# Altium project NNLightSwitcher.PrjPcb (part 2 of 5)

## Sheet NNLightSwitcher_WiFi.SchDoc
size A3
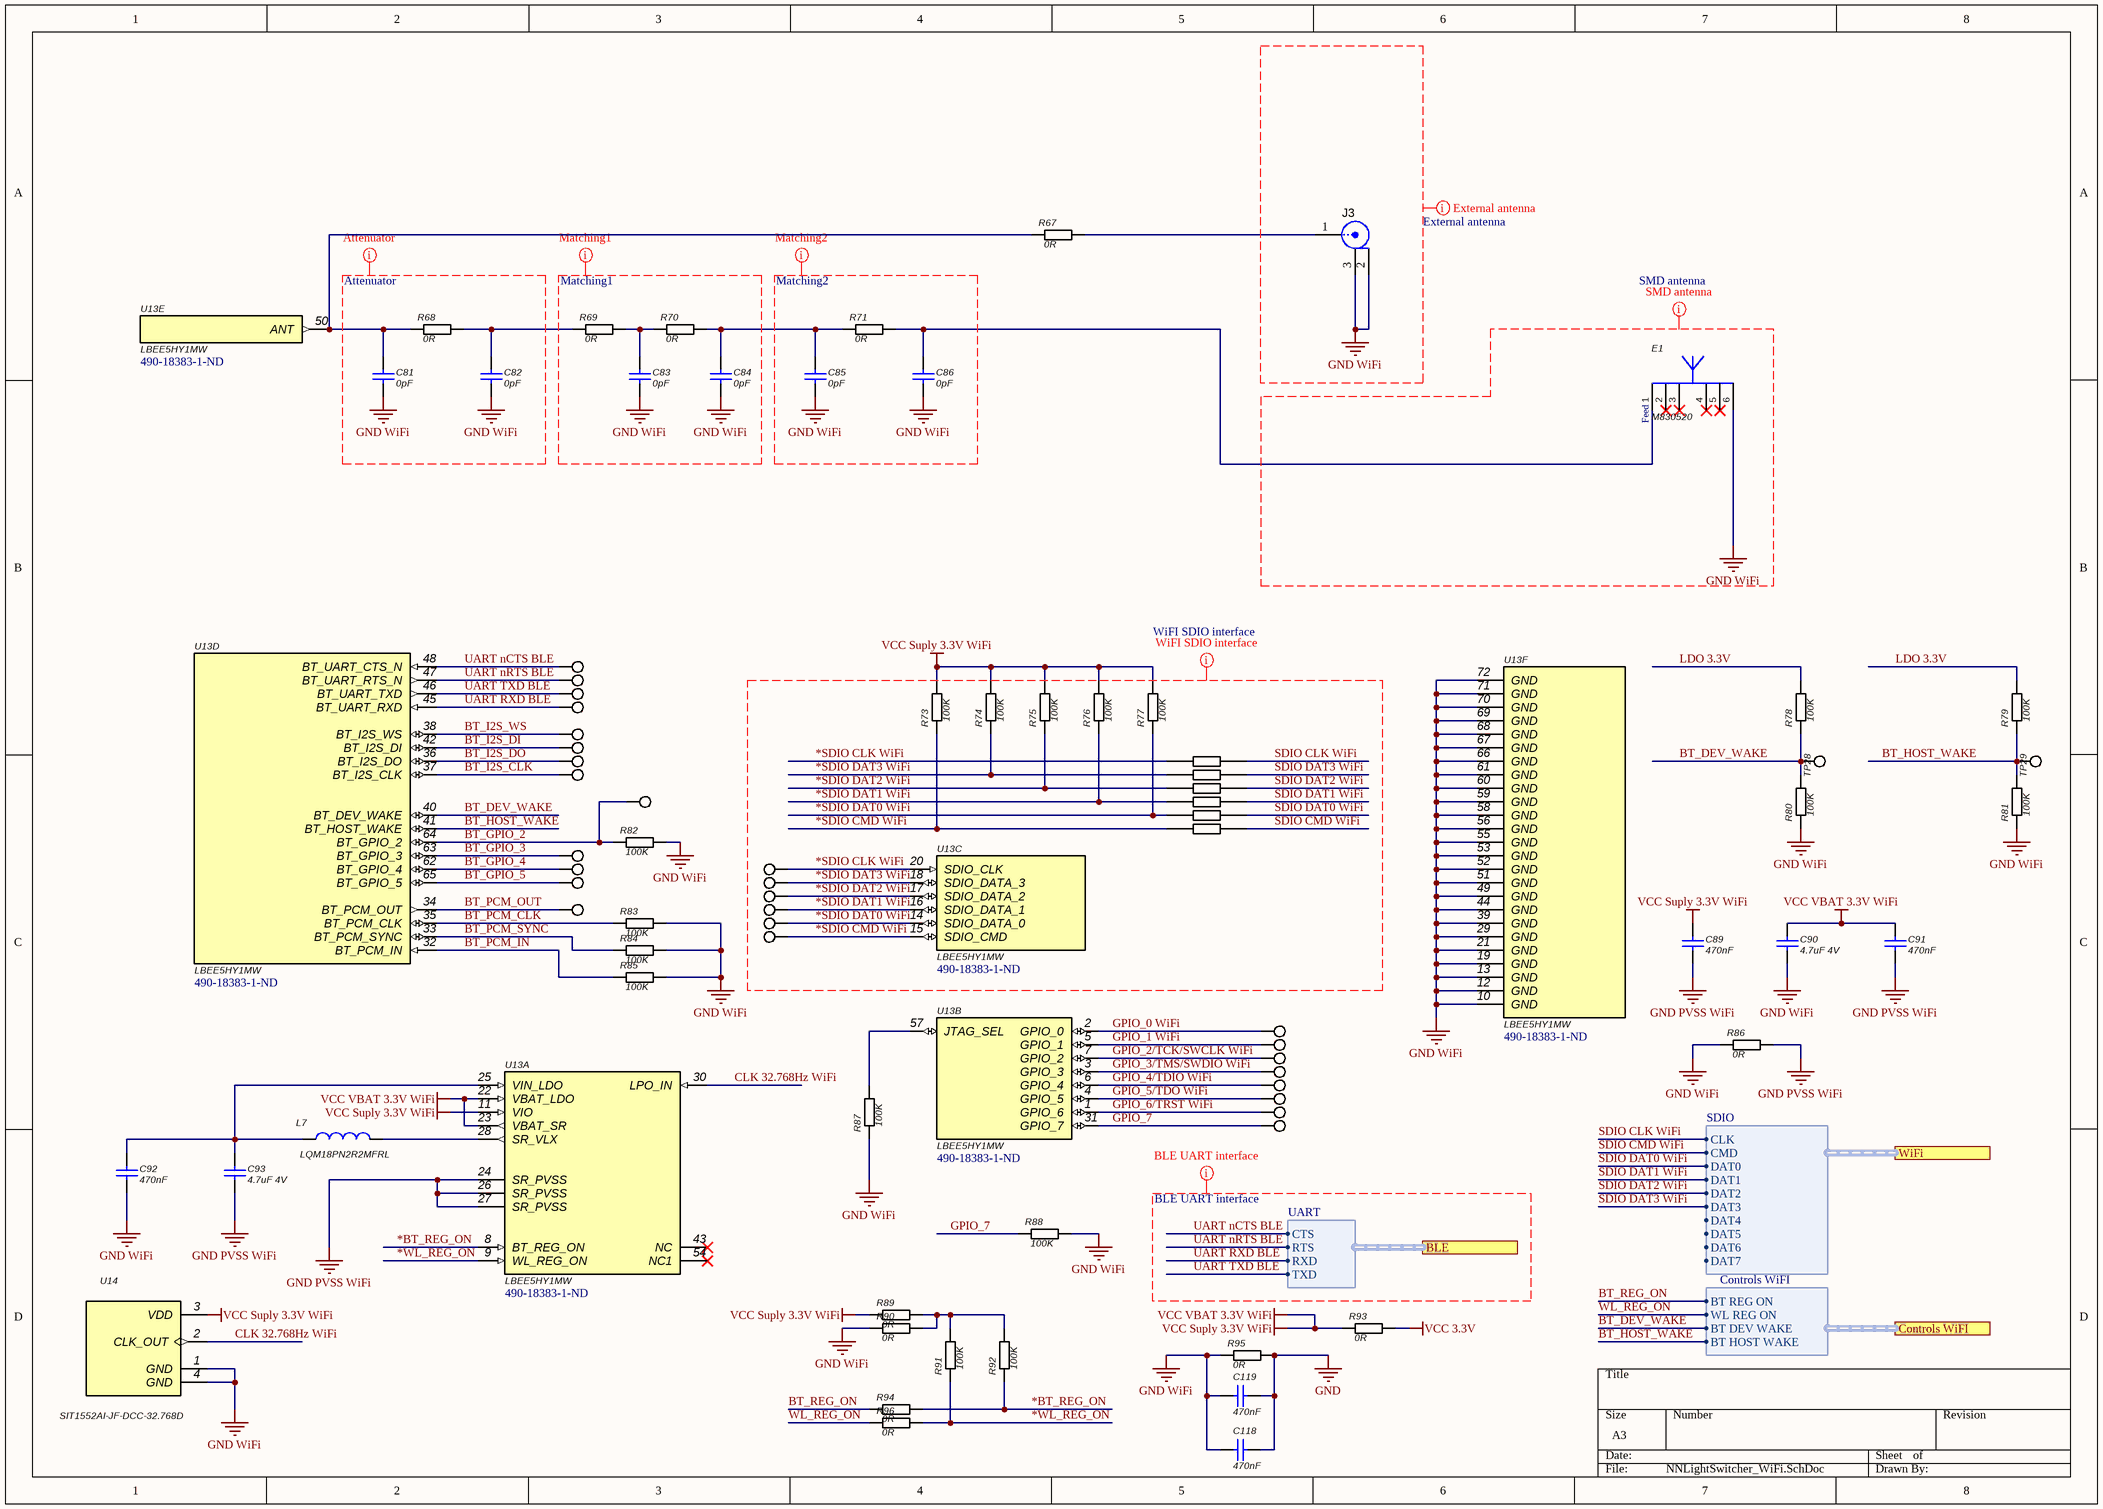
[diagram p6: NNLightSwitcher_WiFi.SchDoc]

### Parts
(Parts that share a designator on the sheet are numbered #1, #2 ... from top to bottom, then left to right.)
C81  0pF  [0402]
C82  0pF  [0402]
C83  0pF  [0402]
C84  0pF  [0402]
C85  0pF  [0402]
C86  0pF  [0402]
C89  470nF  [0402]
C90  4.7uF 4V  [0402]
C91  470nF  [0402]
C92  470nF  [0402]
C93  4.7uF 4V  [0402]
C118  470nF  [0402]
C119  470nF  [0402]
E1  M830520  [Ethertronics_M830520]
J3#1  U.FL-R-SMT-1(01)  [CONN_UFL-R-SMT-1]  (value not drawn)
L7  LQM18PN2R2MFRL  [*0603]
R67  0R  [0402]
R68  0R  [0402]
R69  0R  [0402]
R70  0R  [0402]
R71  0R  [0402]
R73  100K  [0402]
R74  100K  [0402]
R75  100K  [0402]
R76  100K  [0402]
R77  100K  [0402]
R78  100K  [0402]
R79  100K  [0402]
R80  100K  [0402]
R81  100K  [0402]
R82  100K  [0402]
R83  100K  [0402]
R84  100K  [0402]
R85  100K  [0402]
R86  0R  [0402]
R87  100K  [0402]
R88  100K  [0402]
R89  0R  [0402]
R90  0R  [0402]
R91  100K  [0402]
R92  100K  [0402]
R93  0R  [0402]
R94  0R  [0402]
R95  0R  [0402]
R96  0R  [0402]
RN27  EXB-2HV431JV  [*RESCAXE50P380X160X55-16N]  (value not drawn)  (parts A,B,C,D,E,F of 8)
TP21  Test point  [Testpoint_with_pad]  (value not drawn)
TP22  Test point  [Testpoint_with_pad]  (value not drawn)
TP23  Test point  [Testpoint_with_pad]  (value not drawn)
TP24  Test point  [Testpoint_with_pad]  (value not drawn)
TP25  Test point  [Testpoint_with_pad]  (value not drawn)
TP26  Test point  [Testpoint_with_pad]  (value not drawn)
TP27  Test point  [Testpoint_with_pad]  (value not drawn)
TP28  Test point  [Testpoint_with_pad]  (value not drawn)
TP29  Test point  [Testpoint_with_pad]  (value not drawn)
TP30  Test point  [Testpoint_with_pad]  (value not drawn)
TP31  Test point  [Testpoint_Keystone_Miniature]  (value not drawn)
TP32  Test point  [Testpoint_Keystone_Miniature]  (value not drawn)
TP33  Test point  [Testpoint_Keystone_Miniature]  (value not drawn)
TP34  Test point  [Testpoint_with_pad]  (value not drawn)
TP35  Test point  [Testpoint_Keystone_Miniature]  (value not drawn)
TP36  Test point  [Testpoint_with_pad]  (value not drawn)
TP37  Test point  [Testpoint_with_pad]  (value not drawn)
TP38  Test point  [Testpoint_Keystone_Miniature]  (value not drawn)
TP39  Test point  [Testpoint_with_pad]  (value not drawn)
TP40  Test point  [Testpoint_with_pad]  (value not drawn)
TP41  Test point  [Testpoint_with_pad]  (value not drawn)
TP42  Test point  [Testpoint_with_pad]  (value not drawn)
TP43  Test point  [Testpoint_with_pad]  (value not drawn)
TP44  Test point  [Testpoint_with_pad]  (value not drawn)
TP45  Test point  [Testpoint_with_pad]  (value not drawn)
TP46  Test point  [Testpoint_with_pad]  (value not drawn)
TP47  Test point  [Testpoint_with_pad]  (value not drawn)
TP48  Test point  [Testpoint_with_pad]  (value not drawn)
TP49  Test point  [Testpoint_Keystone_Miniature]  (value not drawn)
U13  LBEE5HY1MW  Supplier Part Number 1: 490-18383-1-ND  [1MW LGA]  (parts A,B,C,D,E,F of 6)
U14  SIT1552AI-JF-DCC-32.768D  [*BGA4C100X41P2X2_154X84X60N]

### Ports
BLE (harness UART), Controls WiFI (harness Controls WiFI), WiFi (harness SDIO)

### Harnesses
SDIO: CLK, CMD, DAT1, DAT0, DAT3, DAT2, DAT5, DAT4, DAT7, DAT6
Controls WiFI: BT DEV WAKE, WL REG ON, BT REG ON, BT HOST WAKE
UART: CTS, RTS, RXD, TXD

### Nets
GND: C118.2 C119.2 R95.2
GND PVSS WiFi: C89.2 C91.2 C93.2 R86.2 U13.24(SR_PVSS) U13.26(SR_PVSS) U13.27(SR_PVSS)
GND WiFi: C81.2 C82.2 C83.2 C84.2 C85.2 C86.2 C90.2 C92.2 C118.1 C119.1 E1.6 J3#1.2 J3#1.3 R80.1 R81.1 R82.2 R83.2 R84.2 R85.2 R86.1 R87.1 R88.2 R90.1 R95.1 U13.10(GND) U13.12(GND) U13.13(GND) U13.19(GND) U13.21(GND) U13.29(GND) U13.39(GND) U13.44(GND) U13.49(GND) U13.51(GND) U13.52(GND) U13.53(GND) U13.55(GND) U13.56(GND) U13.58(GND) U13.59(GND) U13.60(GND) U13.61(GND) U13.66(GND) U13.67(GND) U13.68(GND) U13.69(GND) U13.70(GND) U13.71(GND) U13.72(GND) U14.1(GND) U14.4(GND)
VCC 3.3V: R93.2
VCC Suply 3.3V WiFi: C89.1 C90.1 C91.1 R73.2 R74.2 R75.2 R76.2 R77.2 R89.1 R93.1 U13.11(VIO) U13.22(VBAT_LDO) U13.23(VBAT_SR) U14.3(VDD)  [also labelled VCC VBAT 3.3V WiFi]
*BT_REG_ON: R92.1 R94.2 U13.8(BT_REG_ON)
*SDIO CLK WiFi: RN27.1 TP34.1 U13.20(SDIO_CLK)
*SDIO CMD WiFi: R73.1 RN27.4 TP41.1 U13.15(SDIO_CMD)
*SDIO DAT0 WiFi: R77.1 RN27.2 TP40.1 U13.14(SDIO_DATA_0)
*SDIO DAT1 WiFi: R76.1 RN27.6 TP39.1 U13.16(SDIO_DATA_1)
*SDIO DAT2 WiFi: R75.1 RN27.3 TP37.1 U13.17(SDIO_DATA_2)
*SDIO DAT3 WiFi: R74.1 RN27.5 TP36.1 U13.18(SDIO_DATA_3)
*WL_REG_ON: R91.1 R96.2 U13.9(WL_REG_ON)
BT_DEV_WAKE: R78.1 R80.2 TP28.1 U13.40(BT_DEV_WAKE) ; port Controls WiFI.BT DEV WAKE
BT_GPIO_2: R82.1 TP31.1 U13.64(BT_GPIO_2)
BT_GPIO_3: TP32.1 U13.63(BT_GPIO_3)
BT_GPIO_4: TP33.1 U13.62(BT_GPIO_4)
BT_GPIO_5: TP35.1 U13.65(BT_GPIO_5)
BT_HOST_WAKE: R79.1 R81.2 TP29.1 U13.41(BT_HOST_WAKE) ; port Controls WiFI.BT HOST WAKE
BT_I2S_CLK: TP30.1 U13.37(BT_I2S_CLK)
BT_I2S_DI: TP26.1 U13.42(BT_I2S_DI)
BT_I2S_DO: TP27.1 U13.36(BT_I2S_DO)
BT_I2S_WS: TP25.1 U13.38(BT_I2S_WS)
BT_PCM_CLK: R83.1 U13.35(BT_PCM_CLK)
BT_PCM_IN: R85.1 U13.32(BT_PCM_IN)
BT_PCM_OUT: TP38.1 U13.34(BT_PCM_OUT)
BT_PCM_SYNC: R84.1 U13.33(BT_PCM_SYNC)
BT_REG_ON: R94.1 ; port Controls WiFI.BT REG ON
CLK 32.768Hz WiFi: U13.30(LPO_IN) U14.2(CLK_OUT)
GPIO_0 WiFi: TP42.1 U13.2(GPIO_0)
GPIO_1 WiFi: TP43.1 U13.5(GPIO_1)
GPIO_2/TCK/SWCLK WiFi: TP44.1 U13.7(GPIO_2)
GPIO_3/TMS/SWDIO WiFi: TP45.1 U13.3(GPIO_3)
GPIO_4/TDIO WiFi: TP46.1 U13.6(GPIO_4)
GPIO_5/TDO WiFi: TP47.1 U13.4(GPIO_5)
GPIO_6/TRST WiFi: TP48.1 U13.1(GPIO_6)
GPIO_7: R88.1 TP49.1 U13.31(GPIO_7)
LDO 3.3V: R78.2 R79.2
SDIO CLK WiFi: RN27.16 ; port WiFi.CLK
SDIO CMD WiFi: RN27.13 ; port WiFi.CMD
SDIO DAT0 WiFi: RN27.15 ; port WiFi.DAT0
SDIO DAT1 WiFi: RN27.11 ; port WiFi.DAT1
SDIO DAT2 WiFi: RN27.14 ; port WiFi.DAT2
SDIO DAT3 WiFi: RN27.12 ; port WiFi.DAT3
UART nCTS BLE: TP21.1 U13.48(BT_UART_CTS_N) ; port BLE.CTS  [project net GPIO26]
UART nRTS BLE: TP22.1 U13.47(BT_UART_RTS_N) ; port BLE.RTS  [project net GPIO14]
UART RXD BLE: TP24.1 U13.45(BT_UART_RXD) ; port BLE.RXD
UART TXD BLE: TP23.1 U13.46(BT_UART_TXD) ; port BLE.TXD
WL_REG_ON: R96.1 ; port Controls WiFI.WL REG ON  [project net GPIO16]
NetC81_1: C81.1 R67.1 R68.1 U13.50(ANT)
NetC82_1: C82.1 R68.2 R69.1
NetC83_1: C83.1 R69.2 R70.1
NetC84_1: C84.1 C85.1 R70.2 R71.1
NetC86_1: C86.1 E1.1(Feed) R71.2
NetC92_1: C92.1 C93.1 L7.1 U13.25(VIN_LDO)
NetJ3#1_1: J3#1.1 R67.2
NetL7_2: L7.2 U13.28(SR_VLX)
NetR87_2: R87.2 U13.57(JTAG_SEL)
NetR89_2: R89.2 R90.2 R91.2 R92.2

Not connected (* = marked no-connect by the designer): E1 2(GND)* 3(GND)* 4(Feed)* 5*; U13 43(NC)* 54(NC1)*

### Layout directives
net class Attenuator: GND WiFi
net class Matching1: GND WiFi
net class Matching2: GND WiFi
net class SMD antenna: GND WiFi
net class External antenna: GND WiFi
net class WiFI SDIO interface: *SDIO CLK WiFi, *SDIO CMD WiFi, *SDIO DAT0 WiFi, *SDIO DAT1 WiFi, *SDIO DAT2 WiFi, *SDIO DAT3 WiFi, SDIO CLK WiFi, SDIO CMD WiFi, SDIO DAT0 WiFi, SDIO DAT1 WiFi, SDIO DAT2 WiFi, SDIO DAT3 WiFi
net class BLE UART interface: UART nCTS BLE, UART nRTS BLE, UART RXD BLE, UART TXD BLE

### Notes on the sheet
- (near E1) Feed
- “Attenuator” part should be pi-network as above.
  Appropriate value of R depends on the design of the product.
  Put 0 ohm in series and no load in parallel on the initial design.
- “Matching1” part should be pi-network + 1 series component as above.
  Appropriate value of L/C/R depends on the design of the product.
  Put 0 ohm in series and no load in parallel on the initial design.
- “Matching2” part should be pi-network as above.
  Only matching1 might achieve the antenna tuning, but if you have a place
  to have this part, please add it.
  Appropriate value of L/C/R depends on the design of the product.
  Put 0 ohm in series and no load in parallel on the initial design.
- Open: SDIO interface voltage=1.8V
  10kohm PD: SDIO interface voltage=3.3V

### Library data of the parts
C81-C86 = Capacitor 0pF: ComponentLink1Description: Datasheet link; ComponentLink1URL: http://www.yageo.com/documents/recent/UPY-GP_NP0_16V-to-50V_16.pdf
C89 C91 C92 C118 C119 = Capacitor 470nF: ComponentLink1Description: Datasheet link; ComponentLink1URL: http://www.yageo.com/documents/recent/UPY-GP_NP0_16V-to-50V_16.pdf
C90 C93 = Capacitor 4.7uF 4V: ComponentLink1Description: Datasheet link; ComponentLink1URL: http://www.yageo.com/documents/recent/UPY-GP_NP0_16V-to-50V_16.pdf
E1 = 2.4-5 GHz antenna: WLAN ANTENNA 802.11, SMD; Manufacturer 1: Ethertronics; ComponentLink1Description: Datasheet URL; ComponentLink1URL: http://www.ethertronics.com/files/6014/0708/4228/Savvi_WLAN__8x3_M830510.pdf; Supplier 1: Digi-Key; Manufacturer Part Number 1: M830520; Stock 1: 10391; Pricing 1: 1=2,09000, 10=1,87400, 25=1,76800, 100=1,50630, 250=1,41440, 500=1,23760 (USD); RoHS: No; ComponentLink2URL: https://media.digikey.com/pdf/Data%20Sheets/Ethertronics/M830520.pdf?src-supplier=Digi-Key; ComponentLink2Description: https://media.digikey.com/pdf/Data%20Sheets/Ethertronics/M830520.pdf?src-supplier=Digi-Key; Supplier Part Number 1: 939-1070-1-ND
J3#1 = CMP-0075320-1: Receptacle, Ultra Miniature Coaxial, Male Pin, 50 ohm, SMT; Manufacturer: Hirose Electric Co. Ltd.; Alternate Manufacturer: ----; CNHeader: False; Gender: Female; ContactFinish: Gold; PartNumber: U.FL-R-SMT-1(01); PackageReference: Ultra small CO-AX SMD; CompType: Receptacle; RoHS: Y; MountType: SMT; ComponentLink1Description: Datasheet URL; ComponentLink1URL: https://www.hirose.com/product/en/download_file/key_name/U.FL%2DR%2DSMT%2D1%2801%29/category/Drawing%20(2D)/doc_file_id/37625/?file_category_id=6&item_id=03310472201&is_series=; Publisher: Texas Instruments; LatestRevisionDate: 2017-07-12; Alternate PartNumber: ----; Supplier 1: Digi-Key; Supplier Part Number 1: H122041-ND; Supplier 2: Newark; Supplier Part Number 2: 18K7517; Supplier 3: Mouser; Supplier Part Number 3: 798-U.FL-R-SMT01; Color: Beige; PinCount: 3; Orientation: Vertical; CT: False
L7 = LQM18PN2R2MFRL: Inductor Power Chip Shielded Multi-Layer 2.2uH 20% 1MHz Ferrite 750mA 375mOhm DCR 0603 T/R; Manufacturer 1: Murata; DC Resistance (DCR): 375mR; Self Resonant Frequency: 70MHz; Value: *; Case/Package: 0603; Case Code (Imperial): 0603; Case Code (Metric): 1608; ComponentLink1Description: https://datasheet.ciiva.com/29691/o05e-29691382.pdf?src-supplier=Digi-Key; ComponentLink1URL: https://datasheet.ciiva.com/29691/o05e-29691382.pdf?src-supplier=Digi-Key; Core Material: Ferrite; Current Rating: 750mA; DC Current: 750mA; Depth: 0.95mm; Height - Seated (Max): 0.037inch; Height: 0.8mm; Inductance: 2.2uH; Lead Free: Lead Free; Length: 0.063inch; Manufacturer 2: Murata; Manufacturer Part Number 1: LQM18PN2R2MFRL; Manufacturer Part Number 2: LQM18PN2R2MFRL; Max DC Current: 750mA; Max Operating Temperature: 85°C; Military Standard: Not; Min Operating Temperature: -40°C; Mount: Surface Mount; Package Quantity: 4000; Packaging: Tape and Reel; Pricing 1: 1=0,42000, 10=0,37000, 100=0,25430, 500=0,21728, 1000=0,16643 (USD); Pricing 2: 1=0,42000, 10=0,37000, 50=0,37000, 100=0,25400, 500=0,21700, 1000=0,16600, 4000=0,13700, 8000=0,12500, 10000=0,12500, 24000=0,12100, 48000=0,11500 (USD); RoHS: Yes; Shielding: Shielded; Stock 1: 15081; Stock 2: 12449; Supplier 1: Digi-Key; Supplier 2: Mouser; Supplier Part Number 1: 490-10764-1-ND; Supplier Part Number 2: 81-LQM18PN2R2MFRL; Termination: SMD/SMT; Test Frequency: 1MHz; Tolerance: 20%; Weight: 0.000141oz; Width: 0.031inch
R67-R71 R86 R89 R90 R93-R96 = Resistor 0R
R73-R85 R87 R88 R91 R92 = Resistor 100K
RN27 = EXB-2HV431JV: Res Thick Film Array; Value: 33 R
TP21-TP49 = Test point: Test Point, Miniature, SMT; ComponentLink1Description: Datasheet URL; ComponentLink1URL: http://www.keyelco.com/userAssets/store/files/5015.PDF
U13 = LBEE5HY1MW: Dual Band WiFi 11a/b/g/n/ac with Bluetooth 5.0 Module; Manufacturer 1: Murata; Manufacturer Part Number 1: LBEE5HY1MW-230; Supplier 1: Digi-Key; Stock 1: 946; Pricing 1: 1=15,66000, 10=14,16500, 25=13,04640, 100=11,92800, 250=11,18252, 500=10,43700, 1000=9,91515 (USD); RoHS: No; Manufacturer 2: Murata; Manufacturer Part Number 2: LBEE5HY1MW-230; Pricing 2: 1=15,62000, 10=14,20000, 25=13,14000, 50=13,14000, 100=12,43000, 250=10,65000, 1000=10,65000, 10000=10,65000 (USD); Stock 2: 212; Supplier 2: Mouser; Supplier Part Number 2: 81-LBEH5HY1MW-230
U14 = SIT1552AI-JF-DCC-32.768D: Ultra Small, Ultra-Low Power 32.768 kHz TCXO; Manufacturer 1: SiTime; Frequency Stability: 10ppm; Value: *; ComponentLink1Description: https://www.sitime.com/products/datasheets/sit1552/SiT1552-datasheet.pdf?src-supplier=Digi-Key; ComponentLink1URL: https://www.sitime.com/products/datasheets/sit1552/SiT1552-datasheet.pdf?src-supplier=Digi-Key; ComponentLink2Description: https://www.sitime.com/datasheet/SiT1552?src-supplier=Digi-Key; ComponentLink2URL: https://www.sitime.com/datasheet/SiT1552?src-supplier=Digi-Key; Frequency: 32.768kHz; Height: 0.024inch; Length: 0.061inch; Manufacturer 2: SiTime; Manufacturer Part Number 1: SIT1552AI-JF-DCC-32.768D; Manufacturer Part Number 2: SIT1552AI-JF-DCC-32.768D; Max Operating Temperature: 85°C; Min Operating Temperature: -40°C; Mount: Surface Mount; Packaging: Tape and Reel; Pricing 1: 1=1,98000, 10=1,88800, 50=1,84400, 100=1,58050, 500=1,53664, 1000=1,29517 (USD); Pricing 2: 1=1,85000, 10=1,74000, 50=1,74000, 100=1,49000, 250=1,42000, 500=1,26000, 1000=1,16000, 3000=1,10000, 6000=1,06000, 9000=1,02000, 10000=1,06000 (USD); RoHS: Yes; Stock 1: 12997; Stock 2: 2903; Supplier 1: Digi-Key; Supplier 2: Mouser; Supplier Part Number 1: 1473-1242-1-ND; Supplier Part Number 2: 788-1552AIJFDCC32.7D; Width: 0.033inch

## Sheet NNLightSwitcher_USB.SchDoc
size A4
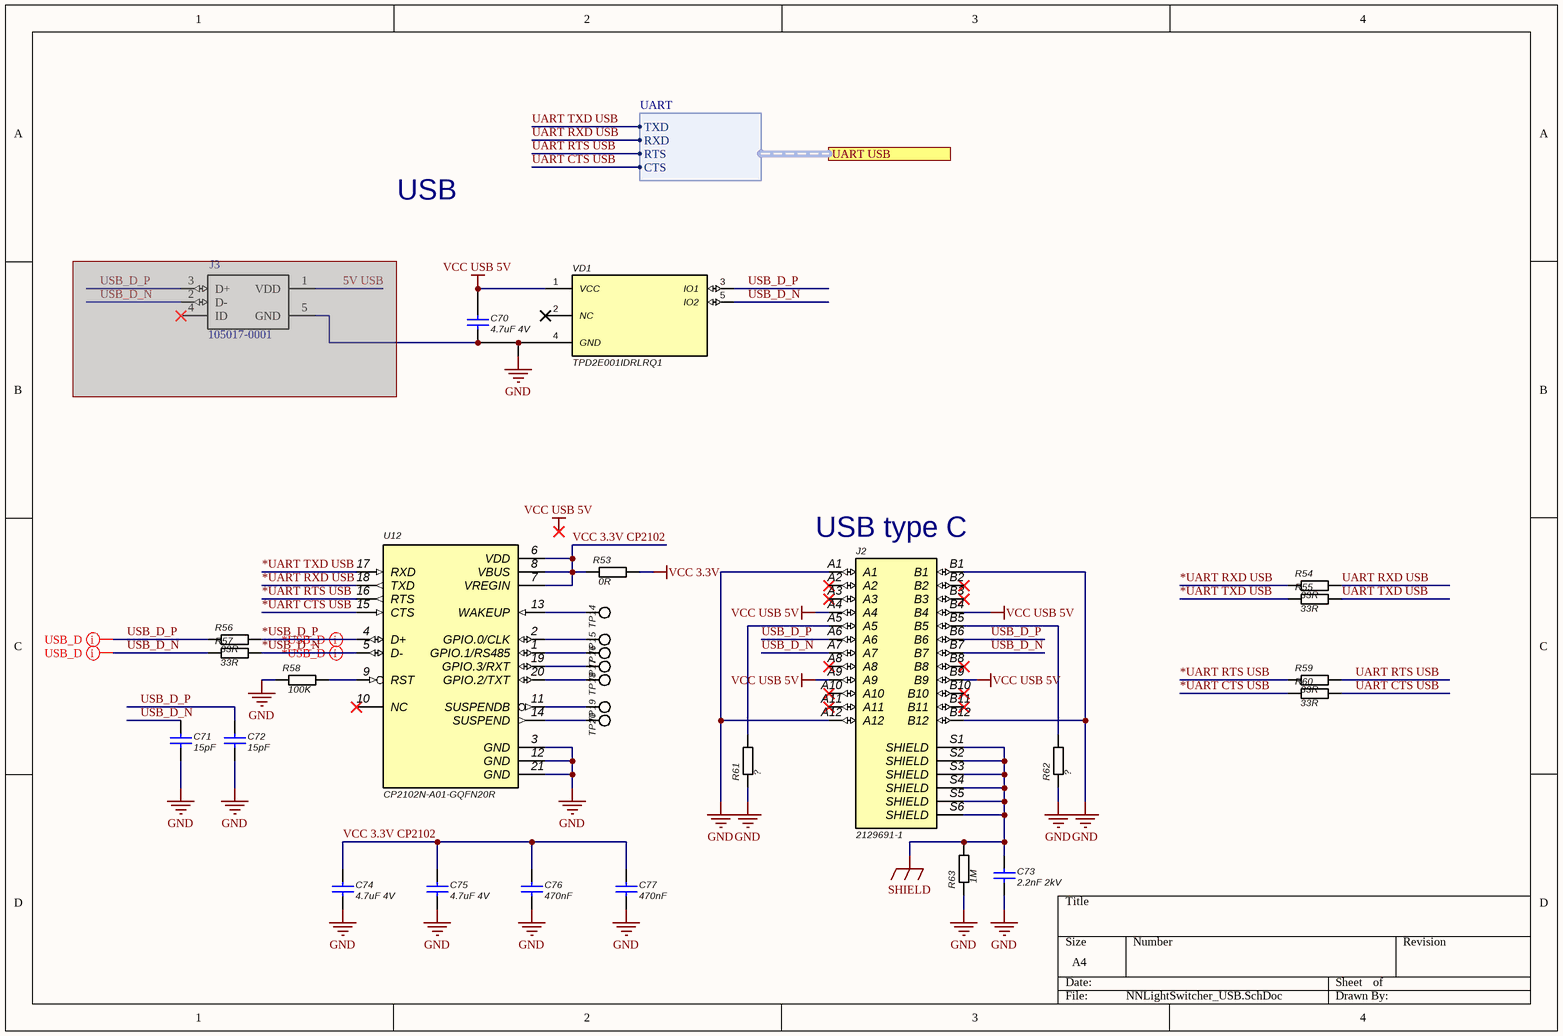
[diagram p7: NNLightSwitcher_USB.SchDoc]

### Parts
(Parts that share a designator on the sheet are numbered #1, #2 ... from top to bottom, then left to right.)
C70  4.7uF 4V  [0402]
C71  15pF  [0402]
C72  15pF  [0402]
C73  2.2nF 2kV  [0402]
C74  4.7uF 4V  [0402]
C75  4.7uF 4V  [0402]
C76  470nF  [0402]
C77  470nF  [0402]
J2  2129691-1  [*TE_2129691-1_2129691-1(Primary)]
J3#2  105017-0001  [MOLEX_105017-0001]  (masked out: inside a compile mask, not in the netlist)
R53  0R  [0402]
R54  33R  [0402]
R55  33R  [0402]
R56  33R  [0402]
R57  33R  [0402]
R58  100K  [0402]
R59  33R  [0402]
R60  33R  [0402]
R61  ?  [0402]
R62  ?  [0402]
R63  1M  [0402]
TP14  Test point  [Testpoint_Keystone_Miniature]  (value not drawn)
TP15  Test point  [Testpoint_Keystone_Miniature]  (value not drawn)
TP16  Test point  [Testpoint_Keystone_Miniature]  (value not drawn)
TP17  Test point  [Testpoint_Keystone_Miniature]  (value not drawn)
TP18  Test point  [Testpoint_Keystone_Miniature]  (value not drawn)
TP19  Test point  [Testpoint_Keystone_Miniature]  (value not drawn)
TP20  Test point  [Testpoint_Keystone_Miniature]  (value not drawn)
U12  CP2102N-A01-GQFN20R  [*SILABS_QFN20]
VD1  TPD2E001IDRLRQ1  [SOT50P160X60-5N]

### Ports
UART USB (harness UART)

### Harnesses
UART: RXD, RTS, TXD, CTS

### Nets
GND: C70.2 C71.2 C72.2 C73.2 C74.2 C75.2 C76.2 C77.2 J2.A1 J2.A12 J2.B1 J2.B12 R58.1 R61.1 R62.1 R63.1 U12.3(GND) U12.12(GND) U12.21(GND) VD1.4(GND)
SHIELD: C73.1 J2.S1(SHIELD) J2.S2(SHIELD) J2.S3(SHIELD) J2.S4(SHIELD) J2.S5(SHIELD) J2.S6(SHIELD) R63.2
VCC 3.3V: R53.2
VCC USB 5V: C70.1 J2.A4 J2.A9 J2.B4 J2.B9 VD1.1(VCC)
*UART CTS USB: R60.1 U12.15(CTS)
*UART RTS USB: R59.1 U12.16(RTS)
*UART RXD USB: R54.1 U12.18(TXD)
*UART TXD USB: R55.1 U12.17(RXD)
*USB_D_N: R57.2 U12.5(D-)
*USB_D_P: R56.2 U12.4(D+)
UART CTS USB: R60.2 ; port UART USB.CTS  [project net GPIO25]
UART RTS USB: R59.2 ; port UART USB.RTS  [project net GPIO23]
UART RXD USB: R54.2 ; port UART USB.RXD
UART TXD USB: R55.2 ; port UART USB.TXD
USB_D_N: C71.1 J2.A7 J2.B7 R57.1 VD1.5(IO2)
USB_D_P: C72.1 J2.A6 J2.B6 R56.1 VD1.3(IO1)
VCC 3.3V CP2102: C74.1 C75.1 C76.1 C77.1 R53.1 U12.6(VDD) U12.7(VREGIN) U12.8(VBUS)
NetJ2_A5: J2.A5 R61.2
NetJ2_B5: J2.B5 R62.2
NetR58_2: R58.2 U12.9(RST)
NetTP14_1: TP14.1 U12.13(WAKEUP)
NetTP15_1: TP15.1 U12.2(GPIO.0/CLK)
NetTP16_1: TP16.1 U12.1(GPIO.1/RS485)
NetTP17_1: TP17.1 U12.19(GPIO.3/RXT)
NetTP18_1: TP18.1 U12.20(GPIO.2/TXT)
NetTP19_1: TP19.1 U12.11(SUSPENDB)
NetTP20_1: TP20.1 U12.14(SUSPEND)

Not connected (* = marked no-connect by the designer): J2 A2* A3* A8* A10* A11* B2* B3* B8* B10* B11*; U12 10(NC)*; VD1 2(NC)*

### Layout directives
differential pair: *USB_D_N, *USB_D_P, USB_D_N, USB_D_P

### Notes on the sheet
- USB
- (near J2) USB type C
- Labels drawn without touching a wire or pin: VCC USB 5V

### Library data of the parts
C70 C74 C75 = Capacitor 4.7uF 4V: ComponentLink1Description: Datasheet link; ComponentLink1URL: http://www.yageo.com/documents/recent/UPY-GP_NP0_16V-to-50V_16.pdf
C71 C72 = Capacitor 15pF: ComponentLink1Description: Datasheet link; ComponentLink1URL: http://www.yageo.com/documents/recent/UPY-GP_NP0_16V-to-50V_16.pdf
C73 = Capacitor 2.2nF 2kV: ComponentLink1Description: Datasheet link; ComponentLink1URL: http://www.yageo.com/documents/recent/UPY-GP_NP0_16V-to-50V_16.pdf
C76 C77 = Capacitor 470nF: ComponentLink1Description: Datasheet link; ComponentLink1URL: http://www.yageo.com/documents/recent/UPY-GP_NP0_16V-to-50V_16.pdf
J2 = USB type C: Conn USB 3.1 Type C RCP 24 POS Solder RA SMD/Thru-Hole 24 Terminal 1 Port Automotive T/R; Manufacturer 1: TE Connectivity AMP; Product_Type: Connector; Centerline_Pitch: .5 mm[.019 in]; Number_of_Positions: 24; MF: TE Connectivity; Plating: Bright; Gender: Receptacle; Plating Thickness: 0.75um; Number of Ports: 1; USB Standard: USB 3.1; Contact Current Rating: 5A; Circuit Application: Signal; Connector System: Cable-to-Board; Pitch: 0.5mm; TE_purchase_URL: https://www.te.com/usa-en/product-2129691-1.html?te_bu=Cor&te_type=disp&te_campaign=seda_glo_cor-seda-global-disp-prtnr-fy19-seda-model-bom-cta_sma-317_1&elqCampaignId=32493; Package: None; MP: 2129691-1; Price: None; Availability: Unavailable; SnapEDA_Link: https://www.snapeda.com/parts/2129691-1/TE%20Connectivity%20AMP%20Connectors/view-part/?ref=snap; Value: *; Supplier 1: Mouser; Manufacturer Part Number 1: 2129691-1; Stock 1: 8733; Pricing 1: 1=2,88000, 10=2,76000, 25=2,53000, 50=2,42000, 100=2,30000, 250=2,01000, 500=1,96000, 1000=1,67000, 2000=1,65000, 10000=1,65000 (USD); RoHS: Yes; Mount: Surface Mount; Number of Pins: 24; Contact Material: Copper Alloy; Contact Plating: Nickel,Gold; Housing Color: Black; Housing Material: Thermoplastic; Min Operating Temperature: -30°C; Max Operating Temperature: 85°C; Orientation: Right Angle; Packaging: Tape and Reel; Termination: Solder; Connector Type: Receptacle; Number of Positions: 24; Length: 12.35mm; REACH SVHC: Unknown; Lead Free: Lead Free; ComponentLink1URL: https://media.digikey.com/pdf/Data%20Sheets/Tyco%20Electonics%20AMP%20PDFs/2129691_Dwg.pdf?src-supplier=Digi-Key; ComponentLink1Description: https://media.digikey.com/pdf/Data%20Sheets/Tyco%20Electonics%20AMP%20PDFs/2129691_Dwg.pdf?src-supplier=Digi-Key; ComponentLink2URL: http://www.farnell.com/datasheets/2292385.pdf?src-supplier=Farnell; ComponentLink2Description: http://www.farnell.com/datasheets/2292385.pdf?src-supplier=Farnell; ComponentLink3URL: http://www.farnell.com/datasheets/1993946.pdf?src-supplier=Farnell; ComponentLink3Description: http://www.farnell.com/datasheets/1993946.pdf?src-supplier=Farnell; ComponentLink4URL: http://www.alliedelec.com/images/products/datasheets/bm/TE_Connectivity/70718395.pdf?src-supplier=Allied+Electronics; ComponentLink4Description: http://www.alliedelec.com/images/products/datasheets/bm/TE_Connectivity/70718395.pdf?src-supplier=Allied+Electronics; ComponentLink5URL: http://www.farnell.com/cad/1993947.pdf?src-supplier=Element14; ComponentLink5Description: http://www.farnell.com/cad/1993947.pdf?src-supplier=Element14; ComponentLink6URL: http://www.farnell.com/datasheets/1993946.pdf?src-supplier=Element14; ComponentLink6Description: http://www.farnell.com/datasheets/1993946.pdf?src-supplier=Element14; ComponentLink7URL: http://www.te.com/commerce/DocumentDelivery/DDEController?Action=showdoc&DocId=Customer+Drawing%7F2129691%7F6%7Fpdf%7FEnglish%7FENG_CD_2129691_6.pdf%7F2129691-1&src-supplier=Avnet+Asia; ComponentLink7Description: http://www.te.com/commerce/DocumentDelivery/DDEController?Action=showdoc&DocId=Customer+Drawing%7F2129691%7F6%7Fpdf%7FEnglish%7FENG_CD_2129691_6.pdf%7F2129691-1&src-supplier=Avnet+Asia; ComponentLink8URL: http://www.te.com/commerce/DocumentDelivery/DDEController?Action=showdoc&DocId=Customer+Drawing%7F2129691%7F6%7Fpdf%7FEnglish%7FENG_CD_2129691_6.pdf%7F2129691-1&src-supplier=Avnet; ComponentLink8Description: http://www.te.com/commerce/DocumentDelivery/DDEController?Action=showdoc&DocId=Customer+Drawing%7F2129691%7F6%7Fpdf%7FEnglish%7FENG_CD_2129691_6.pdf%7F2129691-1&src-supplier=Avnet; Supplier Part Number 1: 571-2129691-1
J3#2 = 105017-0001: Conn USB Type B M 5 POS 0.65mm Solder RA Thru-Hole 5 Terminal 1 Port Embossed T/R; MF: Molex; Package: None; MP: 105017-0001; Availability: Good; Price: 0.50 USD; Value: *
R53 = Resistor 0R
R54-R57 R59 R60 = Resistor 33R
R58 = Resistor 100K
R61 R62 = Resistor generic
R63 = Resistor 1M
TP14-TP20 = Test point: Test Point, Miniature, SMT; ComponentLink1Description: Datasheet URL; ComponentLink1URL: http://www.keyelco.com/userAssets/store/files/5015.PDF
U12 = CP2102N-A01-GQFN20R: Ic Bridge Usb To Uart 20qfn; Manufacturer 1: Silicon Labs; Value: *; ComponentLink1Description: https://www.silabs.com/documents/public/data-sheets/cp2102n-datasheet.pdf?src-supplier=Digi-Key; ComponentLink1URL: https://www.silabs.com/documents/public/data-sheets/cp2102n-datasheet.pdf?src-supplier=Digi-Key; Manufacturer 2: Silicon Labs; Manufacturer Part Number 1: CP2102N-A01-GQFN20R; Manufacturer Part Number 2: CP2102N-A01-GQFN20R; Pricing 1: 1=1,33000, 10=1,31000, 25=1,28000, 50=1,26000, 100=1,23000, 250=1,21000, 500=1,19000, 1000=1,15000, 10000=1,15000 (USD); Pricing 2: 1=1,33000, 25=1,28080, 100=1,23170 (USD); RoHS: No; Stock 1: 3771; Stock 2: 12524; Supplier 1: Mouser; Supplier 2: Digi-Key; Supplier Part Number 1: 634-CP21NA01GQFN20R; Supplier Part Number 2: 336-4826-1-ND
VD1 = TPD2E001IDRLRQ1: Automotive Catalog Low-Capacitance 2-Channel %2B/-15 kV ESD-Protection Array for High-Speed Data Inter 5-SOT -40 to 85

## Sheet NNLightSwitcher_power.SchDoc
size A3
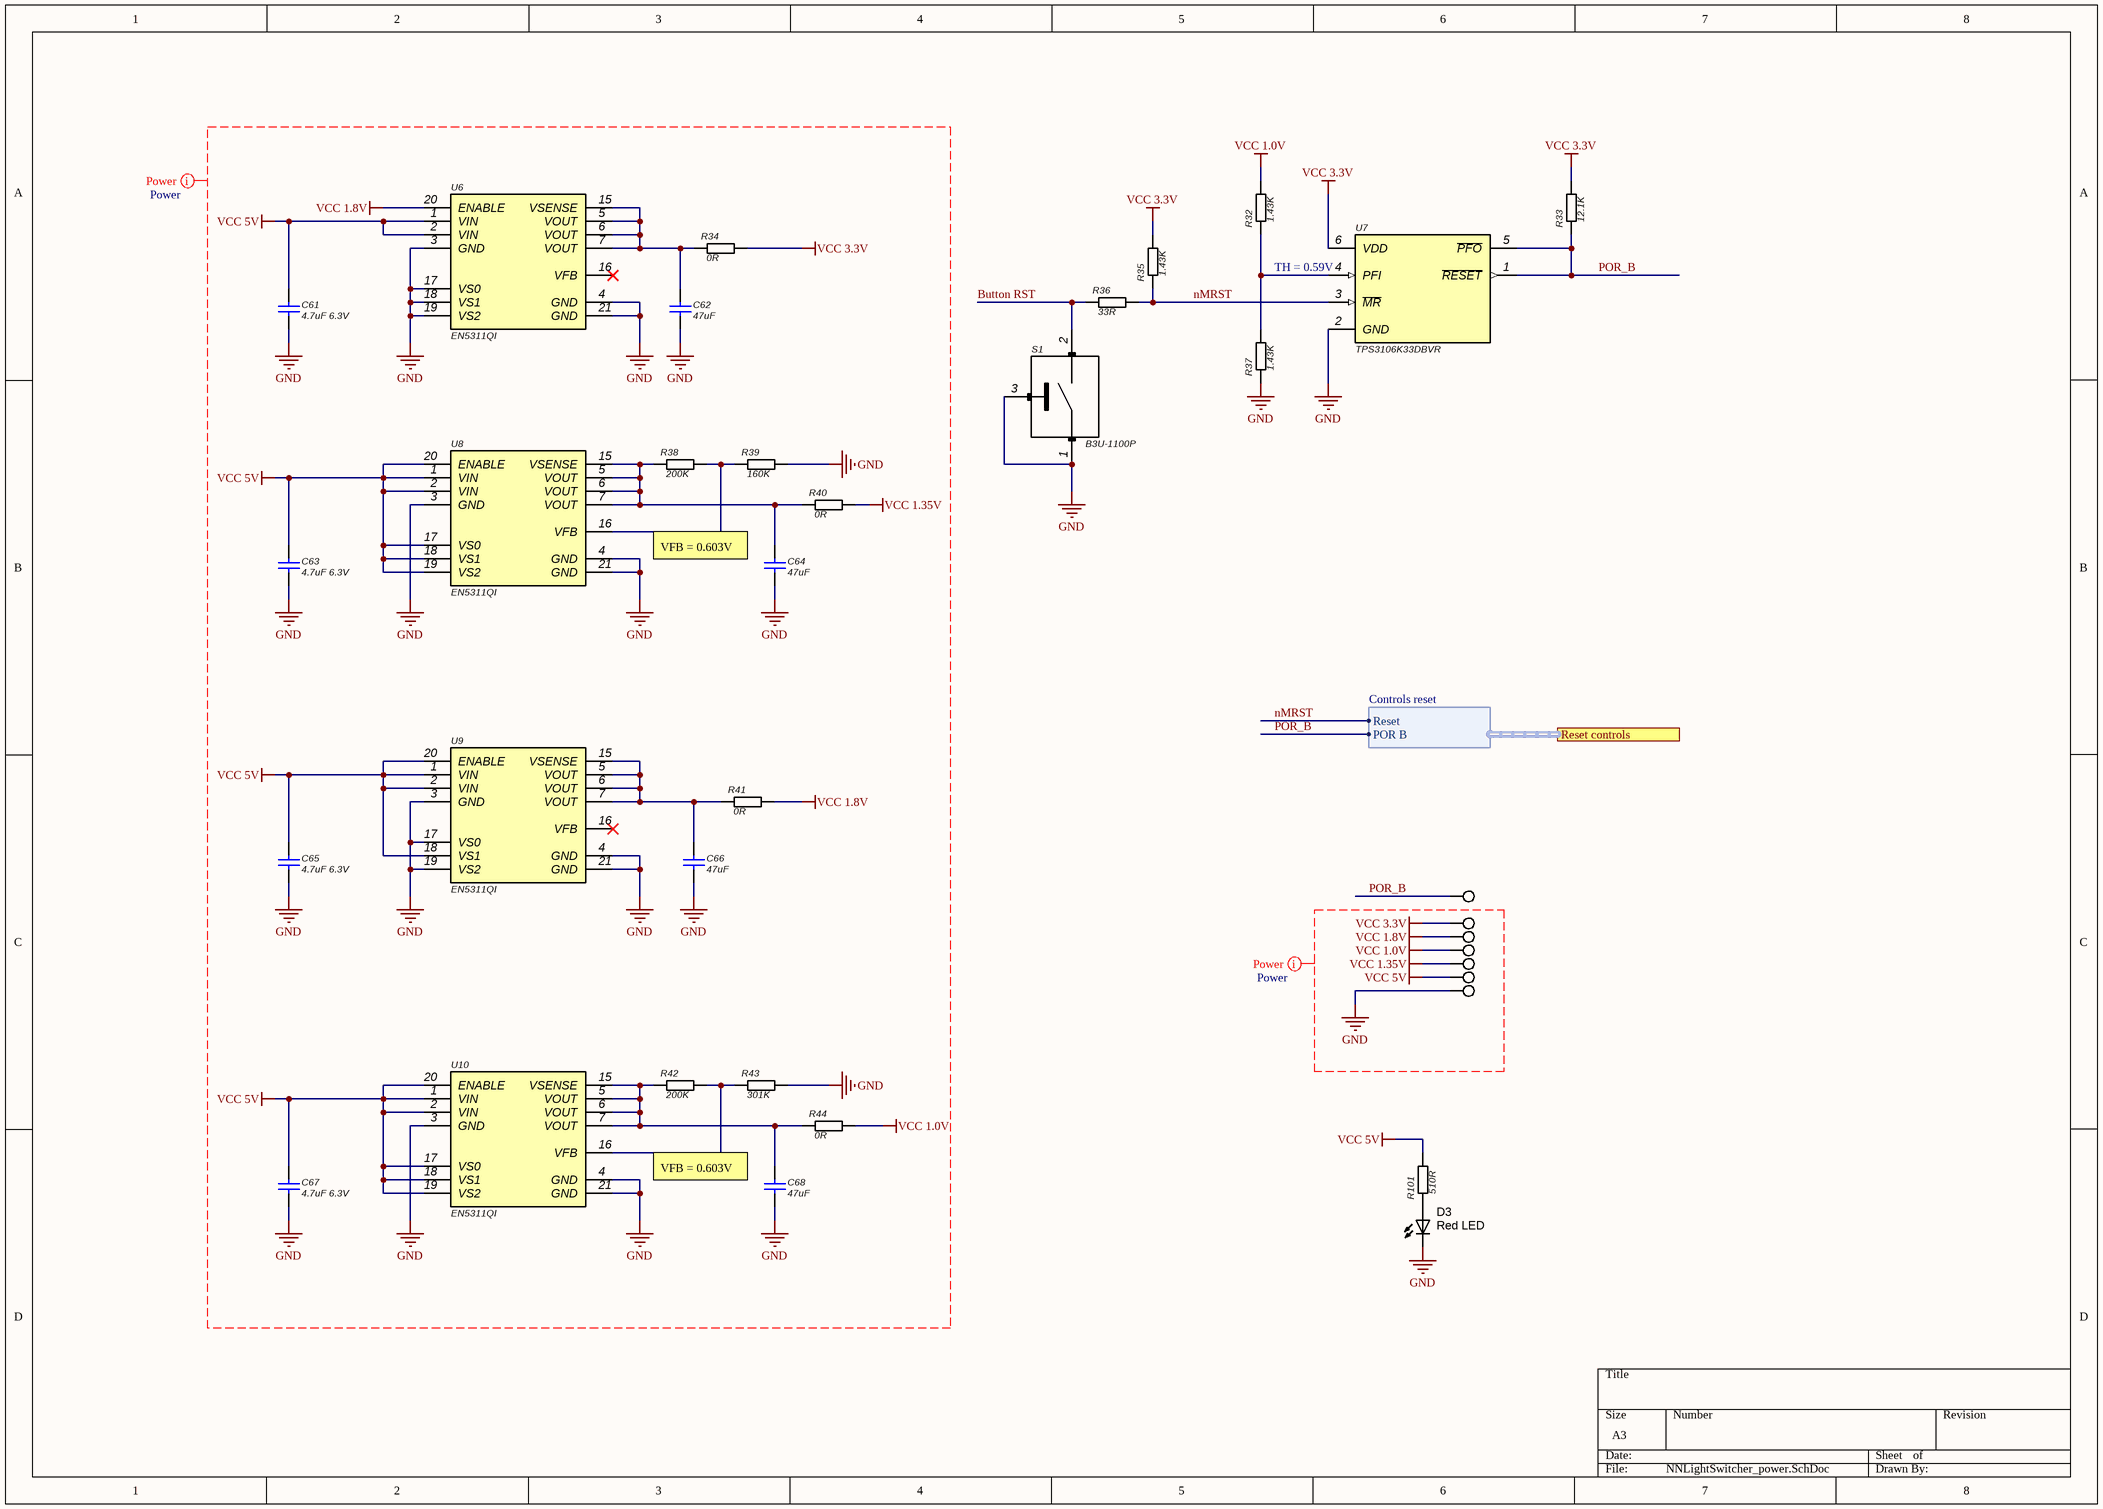
[diagram p8: NNLightSwitcher_power.SchDoc]

### Parts
C61  4.7uF 6.3V  [*0603]
C62  47uF  [Res_0805]
C63  4.7uF 6.3V  [*0603]
C64  47uF  [Res_0805]
C65  4.7uF 6.3V  [*0603]
C66  47uF  [Res_0805]
C67  4.7uF 6.3V  [*0603]
C68  47uF  [Res_0805]
D3  Red LED  [*LED_SML-P11UTT86R_SML-P11MTT86(Primary)]
R32  1.43K  [0402]
R33  12.1K  [0402]
R34  0R  [0402]
R35  1.43K  [0402]
R36  33R  [0402]
R37  1.43K  [0402]
R38  200K  [0402]
R39  160K  [0402]
R40  0R  [0402]
R41  0R  [0402]
R42  200K  [0402]
R43  301K  [0402]
R44  0R  [0402]
R101  510R  [0402]
S1  B3U-1100P  [*SW_B3U-1100P]
TP7  Test point  [Testpoint_Keystone_Miniature]  (value not drawn)
TP8  Test point  [Testpoint_with_pad]  (value not drawn)
TP9  Test point  [Testpoint_with_pad]  (value not drawn)
TP10  Test point  [Testpoint_with_pad]  (value not drawn)
TP11  Test point  [Testpoint_Keystone_Miniature]  (value not drawn)
TP12  Test point  [Testpoint_with_pad]  (value not drawn)
TP13  Test point  [Testpoint_with_pad]  (value not drawn)
U6  EN5311QI  [*QFN_20-PIN_ATMEL_20M1]
U7  TPS3106K33DBVR  [*SOT95P280X145-6N]
U8  EN5311QI  [*QFN_20-PIN_ATMEL_20M1]
U9  EN5311QI  [*QFN_20-PIN_ATMEL_20M1]
U10  EN5311QI  [*QFN_20-PIN_ATMEL_20M1]

### Ports
Reset controls (harness Controls reset)

### Harnesses
Controls reset: POR B, Reset

### Nets
GND: C61.2 C62.2 C63.2 C64.2 C65.2 C66.2 C67.2 C68.2 D3.C R37.1 R39.2 R43.2 S1.1 S1.3 TP13.1 U6.3(GND) U6.4(GND) U6.17(VS0) U6.18(VS1) U6.19(VS2) U6.21(GND) U7.2(GND) U8.3(GND) U8.4(GND) U8.21(GND) U9.3(GND) U9.4(GND) U9.17(VS0) U9.19(VS2) U9.21(GND) U10.3(GND) U10.4(GND) U10.21(GND)
VCC 1.0V: R32.2 R44.2 TP10.1
VCC 1.8V: R41.2 TP9.1 U6.20(ENABLE)
VCC 1.35V: R40.2 TP11.1
VCC 3.3V: R33.2 R34.2 R35.2 TP8.1 U7.6(VDD)
VCC 5V: C61.1 C63.1 C65.1 C67.1 R101.2 TP12.1 U6.1(VIN) U6.2(VIN) U8.1(VIN) U8.2(VIN) U8.17(VS0) U8.18(VS1) U8.19(VS2) U8.20(ENABLE) U9.1(VIN) U9.2(VIN) U9.18(VS1) U9.20(ENABLE) U10.1(VIN) U10.2(VIN) U10.17(VS0) U10.18(VS1) U10.19(VS2) U10.20(ENABLE)
Button RST: R36.1 S1.2
nMRST: R35.1 R36.2 U7.3(~{MR}) ; port Reset controls.Reset
POR_B: R33.1 TP7.1 U7.1(~{RESET}) U7.5(~{PFO}) ; port Reset controls.POR B
NetC62_1: C62.1 R34.1 U6.5(VOUT) U6.6(VOUT) U6.7(VOUT) U6.15(VSENSE)
NetC64_1: C64.1 R38.1 R40.1 U8.5(VOUT) U8.6(VOUT) U8.7(VOUT) U8.15(VSENSE)
NetC66_1: C66.1 R41.1 U9.5(VOUT) U9.6(VOUT) U9.7(VOUT) U9.15(VSENSE)
NetC68_1: C68.1 R42.1 R44.1 U10.5(VOUT) U10.6(VOUT) U10.7(VOUT) U10.15(VSENSE)
NetD3_A: D3.A R101.1
NetR32_1: R32.1 R37.2 U7.4(PFI)
NetR38_2: R38.2 R39.1 U8.16(VFB)
NetR42_2: R42.2 R43.1 U10.16(VFB)

Not connected (* = marked no-connect by the designer): U6 16(VFB)*; U9 16(VFB)*

### Layout directives
net class Power: GND, VCC 1.0V, VCC 1.8V, VCC 1.35V, VCC 3.3V, VCC 5V

### Notes on the sheet
- (near U7) TH = 0.59V
- (near C64) VFB = 0.603V
- (near C68) VFB = 0.603V

### Library data of the parts
C61 C63 C65 C67 = Capacitor 4.7uF 6.3V: ComponentLink1Description: Datasheet link; ComponentLink1URL: http://www.yageo.com/documents/recent/UPY-GP_NP0_16V-to-50V_16.pdf
C62 C64 C66 C68 = Capacitor 47uF: ComponentLink1Description: Datasheet link; ComponentLink1URL: http://www.yageo.com/documents/recent/UPY-GP_NP0_16V-to-50V_16.pdf
D3 = APHHS1005SURCK: LED red 0402; Manufacturer 1: Kingbright; Lens Color: Clear; Forward Current: 20mA; Forward Voltage: 1.95V; Luminous Intensity: 220mcd; Viewing Angle: 120°; Lens Style: Clear,Flat; Dominant Wavelength: 630nm; Number of LEDs: 1; Wavelength: 635nm; ComponentLink1URL: https://datasheet.ciiva.com/15198/getdatasheetpartid-569583-15198505.pdf?src-supplier=Verical; ComponentLink1Description: https://datasheet.ciiva.com/15198/getdatasheetpartid-569583-15198505.pdf?src-supplier=Verical; Supplier 1: Digi-Key; Manufacturer Part Number 1: APHHS1005SURCK; Stock 1: 30423; Pricing 1: 1=0,42000, 10=0,30400, 100=0,19820, 500=0,14248, 1000=0,11151 (USD); RoHS: Yes; Mount: Surface Mount; Case/Package: 0402; Number of Pins: 2; Color: Red; Case Code (Metric): 1005; Case Code (Imperial): 0402; Min Operating Temperature: -40°C; Max Operating Temperature: 85°C; Illumination Color: Red; Packaging: Tape and Reel; Package Quantity: 2000; Test Current: 20mA; Length: 1mm; Height: 0.6mm; Width: 0.5mm; Lead Free: Lead Free; ComponentLink2URL: https://datasheet.ciiva.com/2114/aphhs1005surck-2114140.pdf?src-supplier=Digi-Key; ComponentLink2Description: https://datasheet.ciiva.com/2114/aphhs1005surck-2114140.pdf?src-supplier=Digi-Key; ComponentLink3URL: https://datasheet.ciiva.com/4689/aphhs1005surck-32322-4689068.pdf?src-supplier=Mouser; ComponentLink3Description: https://datasheet.ciiva.com/4689/aphhs1005surck-32322-4689068.pdf?src-supplier=Mouser; ComponentLink4URL: https://datasheet.ciiva.com/14603/70062833-14603899.pdf?src-supplier=Allied+Electronics; ComponentLink4Description: https://datasheet.ciiva.com/14603/70062833-14603899.pdf?src-supplier=Allied+Electronics; ComponentLink5URL: https://datasheet.ciiva.com/2114/aphhs1005surck-2114141.pdf?src-supplier=Digi-Key; ComponentLink5Description: https://datasheet.ciiva.com/2114/aphhs1005surck-2114141.pdf?src-supplier=Digi-Key; ComponentLink6URL: https://datasheet.ciiva.com/2114/aphhs1005surck-2114142.pdf?src-supplier=Digi-Key; ComponentLink6Description: https://datasheet.ciiva.com/2114/aphhs1005surck-2114142.pdf?src-supplier=Digi-Key
R32 R35 R37 = Resistor 1.43K
R33 = Resistor 12.1K
R34 R40 R41 R44 = Resistor 0R
R36 = Resistor 33R
R38 R42 = Resistor 200K
R39 = Resistor 160K
R43 = Resistor 301K
R101 = Resistor 510R
S1 = B3U-1100P: Switch Tactile N.O. SPST Projected Plunger PC Pins 0.05A 24VDC 1.47N Thru-Hole Bag; Manufacturer 1: Omron; Actuator Length: 0.4mm; Actuator Type: Standard; Contact Current Rating: 50mA; Contact Resistance: 100mR; Electrical Life: 200000Cycles; Illumination Type: Non-Illuminated,Illuminated; Max Voltage Rating (DC): 12V; Operating Force: 1.5N; Ratings: Dust Proof; Switch Function: Off-Mom; Switch Travel: 0.15mm; Value: *; ComponentLink1Description: https://datasheet.ciiva.com/1634/60838-1634404.pdf?src-supplier=Farnell; ComponentLink1URL: https://datasheet.ciiva.com/1634/60838-1634404.pdf?src-supplier=Farnell; ComponentLink2Description: https://datasheet.ciiva.com/30197/en-b3u-30197271.pdf?src-supplier=Onlinecomponents.com; ComponentLink2URL: https://datasheet.ciiva.com/30197/en-b3u-30197271.pdf?src-supplier=Onlinecomponents.com; ComponentLink3Description: https://datasheet.ciiva.com/22696/60838-22696216.pdf?src-supplier=Element14; ComponentLink3URL: https://datasheet.ciiva.com/22696/60838-22696216.pdf?src-supplier=Element14; ComponentLink4Description: https://datasheet.ciiva.com/2901/b3u-1110-2901097.pdf?src-supplier=Digi-Key; ComponentLink4URL: https://datasheet.ciiva.com/2901/b3u-1110-2901097.pdf?src-supplier=Digi-Key; ComponentLink5Description: https://datasheet.ciiva.com/2901/b3u-1110-2901098.pdf?src-supplier=Digi-Key; ComponentLink5URL: https://datasheet.ciiva.com/2901/b3u-1110-2901098.pdf?src-supplier=Digi-Key; ComponentLink6Description: https://datasheet.ciiva.com/2901/b3u-1110-2901099.pdf?src-supplier=Digi-Key; ComponentLink6URL: https://datasheet.ciiva.com/2901/b3u-1110-2901099.pdf?src-supplier=Digi-Key; ComponentLink7Description: https://datasheet.ciiva.com/1532/60838-1532684.pdf?src-supplier=Element14; ComponentLink7URL: https://datasheet.ciiva.com/1532/60838-1532684.pdf?src-supplier=Element14; ComponentLink8Description: https://datasheet.ciiva.com/14142/b3u-eng-datasheet-14142541.pdf?src-supplier=Distrelec; ComponentLink8URL: https://datasheet.ciiva.com/14142/b3u-eng-datasheet-14142541.pdf?src-supplier=Distrelec; ComponentLink9Description: https://datasheet.ciiva.com/16155/en-b3u-16155023.pdf?src-supplier=Onlinecomponents.com; ComponentLink9URL: https://datasheet.ciiva.com/16155/en-b3u-16155023.pdf?src-supplier=Onlinecomponents.com; Contact Plating: Silver; Current Rating: 50mA; Depth: 4mm; Lead Free: Lead Free; Length: 3.15mm; Manufacturer Part Number 1: B3U-1100P; Max Current Rating: 50mA; Max Operating Temperature: 70°C; Mechanical Life: 200000Cycles; Min Operating Temperature: -25°C; Mount: Surface Mount; Orientation: Straight; Package Quantity: 1; Packaging: Tape and Reel; Pricing 1: 1=1,00000, 10=0,96100, 25=0,90700, 50=0,79800, 100=0,72600, 250=0,68900, 500=0,61000, 1000=0,52600, 3500=0,51500, 10000=0,51500 (USD); REACH SVHC: Unknown; RoHS: Yes; Stock 1: 10341; Supplier 1: Mouser; Supplier Part Number 1: 653-B3U-1100P; Termination: SMD/SMT; Throw Configuration: SPST; Voltage Rating (DC): 12V; Weight: 0.022g
TP7-TP13 = Test point: Test Point, Miniature, SMT; ComponentLink1Description: Datasheet URL; ComponentLink1URL: http://www.keyelco.com/userAssets/store/files/5015.PDF
U6 U8-U10 = EN5311QI: 1A DC-DC Step-Down Converter; Manufacturer 1: Intel Altera; Efficiency: 95%; Max Input Voltage: 6.6V; Max Output Voltage: 4.9V; Max Power Dissipation: 6W; Min Input Voltage: 2.4V; Min Output Voltage: 600mV; Number of Outputs: 1; Operating Supply Current: 750nA; Output Type: Adjustable; Output Voltage: 6V; Switching Frequency: 4MHz; ComponentLink1Description: Datasheet URL; ComponentLink1URL: https://sps06.itg.ti.com/sites/KMS/crossdivteams/altium/docs/ComponentDatasheets/DPX165950DT-8148A1.pdf; RoHS: Yes; Supplier 1: Mouser; Supplier Part Number 1: 884-EN5311QI; Case/Package: QFN; ComponentLink2Description: https://datasheet.ciiva.com/1162/1525802-1162514.pdf?src-supplier=Element14; ComponentLink2URL: https://datasheet.ciiva.com/1162/1525802-1162514.pdf?src-supplier=Element14; ComponentLink3Description: https://datasheet.ciiva.com/26927/getdatasheetpartid-755172-26927834.pdf?src-supplier=Verical; ComponentLink3URL: https://datasheet.ciiva.com/26927/getdatasheetpartid-755172-26927834.pdf?src-supplier=Verical; ComponentLink4Description: https://datasheet.ciiva.com/29378/en5311qi-03799-29378571.pdf?src-supplier=Digi-Key; ComponentLink4URL: https://datasheet.ciiva.com/29378/en5311qi-03799-29378571.pdf?src-supplier=Digi-Key; ComponentLink5Description: https://datasheet.ciiva.com/29378/en5311qi-03799-29378573.pdf?src-supplier=Digi-Key; ComponentLink5URL: https://datasheet.ciiva.com/29378/en5311qi-03799-29378573.pdf?src-supplier=Digi-Key; Features: UVLO,OCP,OTP,SCP; Height: 0.04inch; Length: 0.2inch; Manufacturer Part Number 1: EN5311QI; Max Operating Temperature: 85°C; Max Output Current: 1A; Min Operating Temperature: -40°C; Min Supply Voltage: 2.4V; Mount: Surface Mount; Number of Pins: 20; Output Current: 1A; Package Quantity: 1; Packaging: Cut Tape; Radiation Hardening: No; REACH SVHC: No SVHC; Stock 1: 0; Voltage - Output 1: 6V; Weight: 0.002751oz; Width: 0.16inch
U7 = TPS3106K33DBVR: Ultra Low-Supply Current/Supply-Voltage Supervisory Circuits 6-SOT-23 -40 to 85; MF: Texas Instruments; MP: TPS3106K33DBVR; Package: SOT-23-6 Texas Instruments; Price: None; Availability: Unavailable; SnapEDA_Link: https://www.snapeda.com/parts/TPS3106K33DBVR/Texas%20Instruments/view-part/?ref=snap; Value: *

## Sheet NNLightSwitcher_analog.SchDoc
size A4
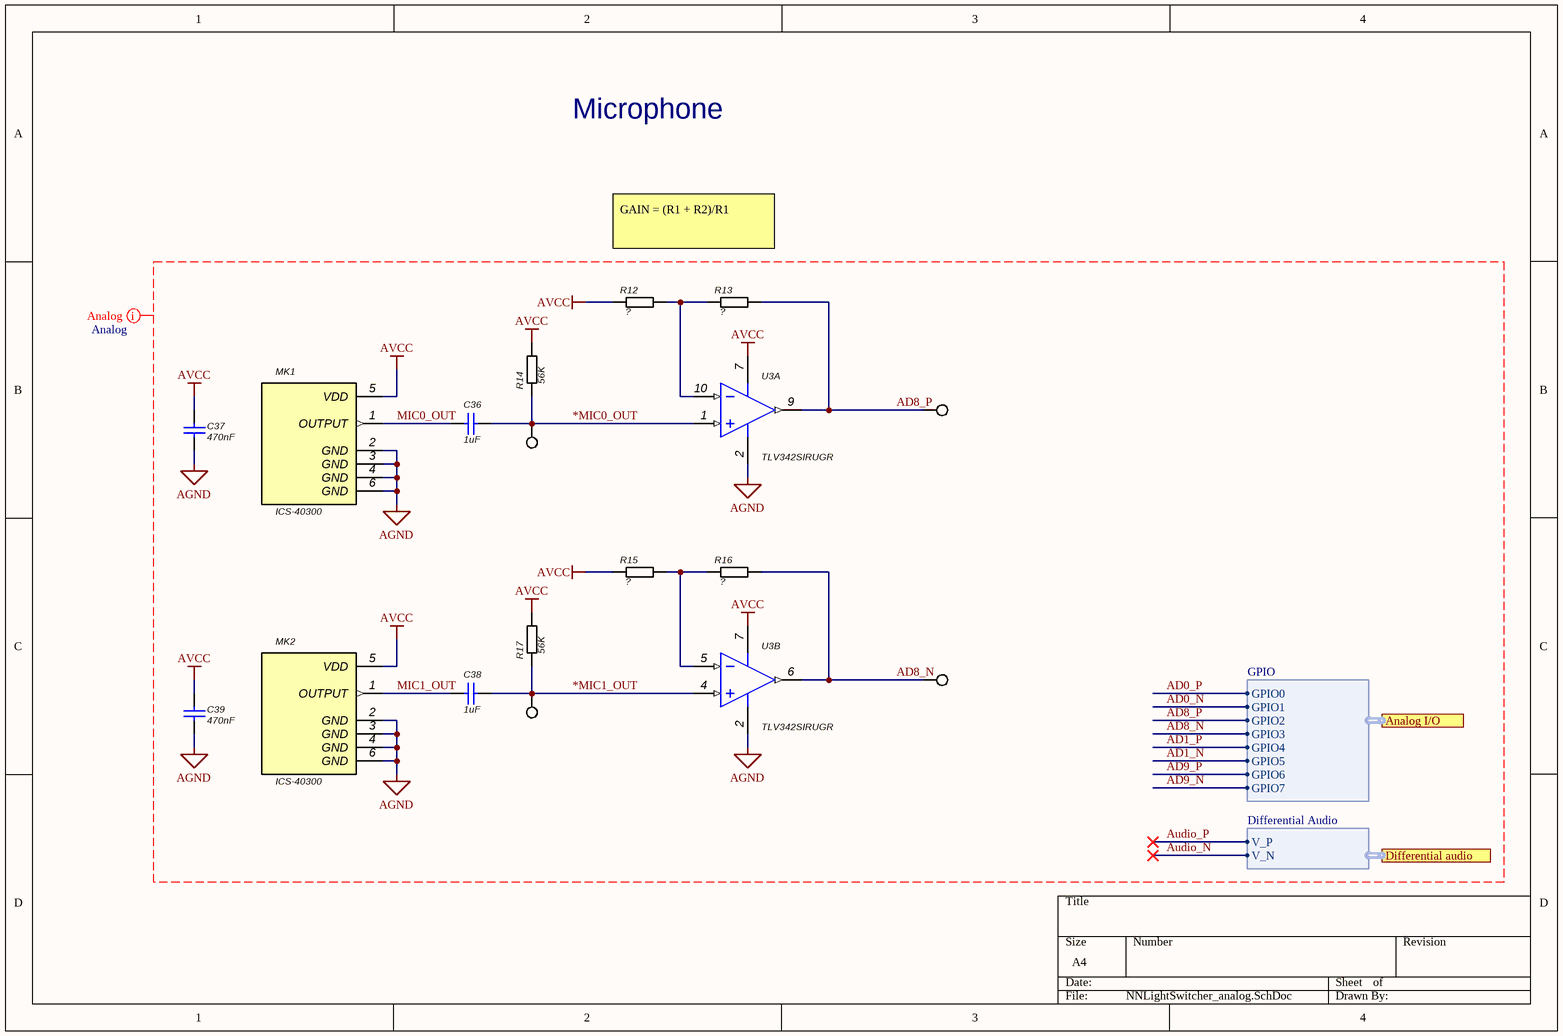
[diagram p9: NNLightSwitcher_analog.SchDoc]

### Parts
C36  1uF  [0402]
C37  470nF  [0402]
C38  1uF  [0402]
C39  470nF  [0402]
MK1  ICS-40300  [*MIC_ICS-40300]
MK2  ICS-40300  [*MIC_ICS-40300]
R12  ?  [0402]
R13  ?  [0402]
R14  56K  [0402]
R15  ?  [0402]
R16  ?  [0402]
R17  56K  [0402]
TP3  Test point  [Testpoint_with_pad]  (value not drawn)
TP4  Test point  [Testpoint_with_pad]  (value not drawn)
TP5  Test point  [Testpoint_with_pad]  (value not drawn)
TP6  Test point  [Testpoint_with_pad]  (value not drawn)
U3  TLV342SIRUGR  [TI-RUG10_V]  (parts A,B of 2)

### Ports
Analog I/O (harness GPIO), Differential audio (harness Differential Audio)

### Harnesses
GPIO: GPIO7, GPIO6, GPIO5, GPIO4, GPIO3, GPIO2, GPIO1, GPIO0
Differential Audio: V_N, V_P

### Nets
AGND: C37.2 C39.2 MK1.2(GND) MK1.3(GND) MK1.4(GND) MK1.6(GND) MK2.2(GND) MK2.3(GND) MK2.4(GND) MK2.6(GND) U3.2(GND)
AVCC: C37.1 C39.1 MK1.5(VDD) MK2.5(VDD) R12.1 R14.2 R15.1 R17.2 U3.7(V+)
*MIC0_OUT: C36.1 R14.1 TP4.1 U3.1(IN1+)
*MIC1_OUT: C38.1 R17.1 TP6.1 U3.4(IN2+)
AD8_N: R16.2 TP5.1 U3.6(OUT2) ; port Analog I/O.GPIO3
AD8_P: R13.2 TP3.1 U3.9(OUT1) ; port Analog I/O.GPIO2
MIC0_OUT: C36.2 MK1.1(OUTPUT)
MIC1_OUT: C38.2 MK2.1(OUTPUT)
NetR12_2: R12.2 R13.1 U3.10(IN1-)
NetR15_2: R15.2 R16.1 U3.5(IN2-)

### Layout directives
net class Analog: *MIC0_OUT, *MIC1_OUT, AD0_N, AD0_P, AD1_N, AD1_P, AD8_N, AD8_P, AD9_N, AD9_P, AGND, Audio_N, Audio_P, AVCC, MIC0_OUT, MIC1_OUT

### Notes on the sheet
- Microphone
- GAIN = (R1 + R2)/R1

### Library data of the parts
C36 C38 = Capacitor 1uF: ComponentLink1Description: Datasheet link; ComponentLink1URL: http://www.yageo.com/documents/recent/UPY-GP_NP0_16V-to-50V_16.pdf
C37 C39 = Capacitor 470nF: ComponentLink1Description: Datasheet link; ComponentLink1URL: http://www.yageo.com/documents/recent/UPY-GP_NP0_16V-to-50V_16.pdf
MK1 MK2 = ICS-40300: High SPL Analog MEMS Microphone with Extended Low Feq Response; Manufacturer 1: TDK InvenSense; Direction: Omnidirectional; Impedance: 200R; Max Supply Voltage: 3.63V; Min Supply Voltage: 1.5V; Operating Supply Current: 250uA; Shape: Rectangular; Value: *; ComponentLink1Description: http://43zrtwysvxb2gf29r5o0athu.wpengine.netdna-cdn.com/wp-content/uploads/2015/02/DS-ICS-40300-00-v1.1.pdf?src-supplier=Avnet+Asia; ComponentLink1URL: http://43zrtwysvxb2gf29r5o0athu.wpengine.netdna-cdn.com/wp-content/uploads/2015/02/DS-ICS-40300-00-v1.1.pdf?src-supplier=Avnet+Asia; ComponentLink2Description: https://www.invensense.com/wp-content/uploads/2015/02/DS-ICS-40300-00-v1.1.pdf?src-supplier=Digi-Key; ComponentLink2URL: https://www.invensense.com/wp-content/uploads/2015/02/DS-ICS-40300-00-v1.1.pdf?src-supplier=Digi-Key; Height: 3.5mm; Lead Free: Lead Free; Length: 4.72mm; Manufacturer Part Number 1: ICS-40300; Output Type: Analog; Packaging: Tape and Reel; Pricing 1: 1=3,00000, 10=2,48900, 25=2,29760, 50=2,15880, 100=2,02510, 500=1,73498, 1000=1,71600 (USD); RoHS: Yes; Stock 1: 3930; Supplier 1: Digi-Key; Supplier Part Number 1: 1428-1027-1-ND; Termination: Solder; Width: 3.76mm
R12 R13 R15 R16 = Resistor generic
R14 R17 = Resistor 56K
TP3-TP6 = Test point: Test Point, Miniature, SMT; ComponentLink1Description: Datasheet URL; ComponentLink1URL: http://www.keyelco.com/userAssets/store/files/5015.PDF
U3 = TLV342SIRUGR: Low-Voltage, Rail-To-Rail Output CMOS Operational Amplifier with Shutdown, 1.5 to 5.5 V, -40 to 125 degC, 10-pin X2QFN (RUG10), Green (RoHS & no Sb/Br); Manufacturer 1: Texas Instruments; Number of Channels: 2; Bandwidth: 2.2MHz; Common Mode Rejection Ratio: 50dB; Gain Bandwidth Product: 2.3MHz; Input Bias Current: 3nA; Input Offset Voltage (Vos): 4mV; Max Supply Voltage: 5.5V; Min Supply Voltage: 1.5V; Nominal Supply Current: 300uA; Operating Supply Current: 75uA; Output Current: 115mA; Slew Rate: 0.9V/µs; Voltage Gain: 110dB; ComponentLink1URL: http://www.ti.com/; ComponentLink1Description: Manufacturer URL; ComponentLink2Description: Datasheet; ComponentLink3URL: http://www.ti.com/litv/pdf/mpqf216a; ComponentLink2URL: http://www.ti.com/lit/ds/symlink/tlv342s.pdf; ComponentLink3Description: Package Specification; Case/Package: QFN; ComponentLink4Description: https://datasheet.ciiva.com/7411/tlv342-7411306.pdf?src-supplier=Newark; ComponentLink4URL: https://datasheet.ciiva.com/7411/tlv342-7411306.pdf?src-supplier=Newark; ComponentLink5Description: https://datasheet.ciiva.com/14458/tlv341-14458822.pdf?src-supplier=Avnet; ComponentLink5URL: https://datasheet.ciiva.com/14458/tlv341-14458822.pdf?src-supplier=Avnet; ComponentLink6Description: https://datasheet.ciiva.com/1797/tlv342-1797900.pdf?src-supplier=Digi-Key; ComponentLink6URL: https://datasheet.ciiva.com/1797/tlv342-1797900.pdf?src-supplier=Digi-Key; ComponentLink7Description: https://datasheet.ciiva.com/1797/tlv342-1797901.pdf?src-supplier=Digi-Key; ComponentLink7URL: https://datasheet.ciiva.com/1797/tlv342-1797901.pdf?src-supplier=Digi-Key; ComponentLink8Description: https://datasheet.ciiva.com/1797/tlv342-1797902.pdf?src-supplier=Digi-Key; ComponentLink8URL: https://datasheet.ciiva.com/1797/tlv342-1797902.pdf?src-supplier=Digi-Key; Lead Free: Lead Free; Manufacturer 2: Texas Instruments; Manufacturer Part Number 1: TLV342SIRUGR; Manufacturer Part Number 2: TLV342SIRUGR; Max I/O Voltage: 4mV; Max Operating Temperature: 125°C; Min Operating Temperature: -40°C; Nominal Gain Bandwidth Product: 2.2MHz; Number of Circuits: 2; Number of Elements: 2; Number of Pins: 10; Output Current per Channel: 115mA; Package Quantity: 3000; Packaging: Tape and Reel; Pricing 1: 1=1,13000, 10=1,00600, 100=0,78410, 500=0,64776, 1000=0,51140 (USD); Pricing 2: 1=1,09000, 10=0,92700, 50=0,92700, 100=0,71200, 500=0,62900, 1000=0,49700, 3000=0,44100, 9000=0,42400, 10000=0,42400 (USD); Radiation Hardening: No; RoHS: Yes; Stock 1: 21365; Stock 2: 4400; Supplier 1: Digi-Key; Supplier 2: Mouser; Supplier Part Number 1: 296-24767-1-ND; Supplier Part Number 2: 595-TLV342SIRUGR; Unity Gain Bandwidth Product: 2.3MHz